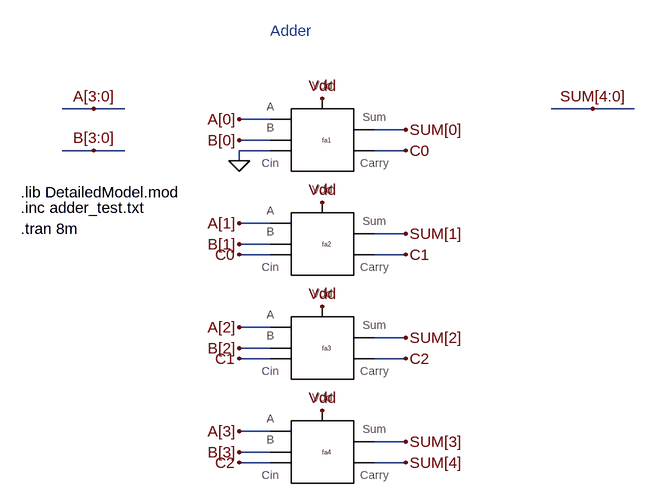
[diagram p0: schematic adder.asc]
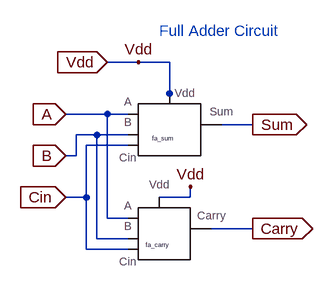
[diagram p1: sub-circuit fa.asc]
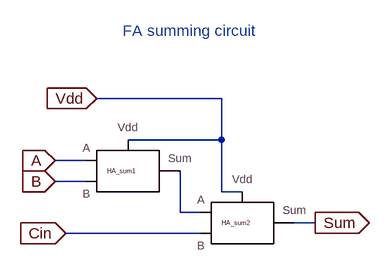
[diagram p2: sub-circuit fa_sum.asc]
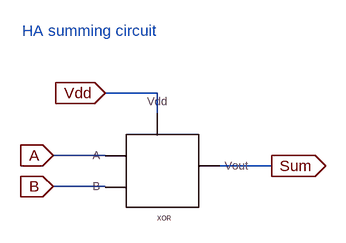
[diagram p3: sub-circuit ha_sum.asc]
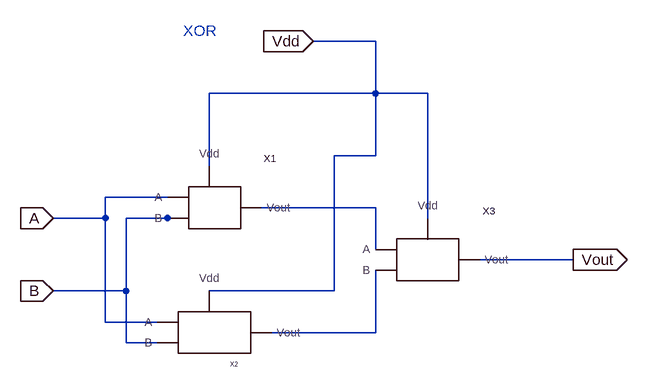
[diagram p4: sub-circuit my_xor.asc]
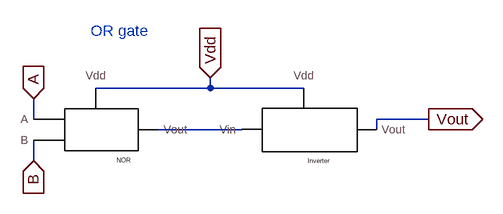
[diagram p5: sub-circuit my_or.asc]
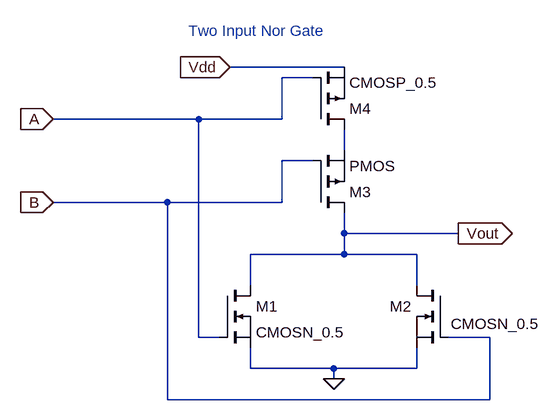
[diagram p6: sub-circuit my_nor.asc]
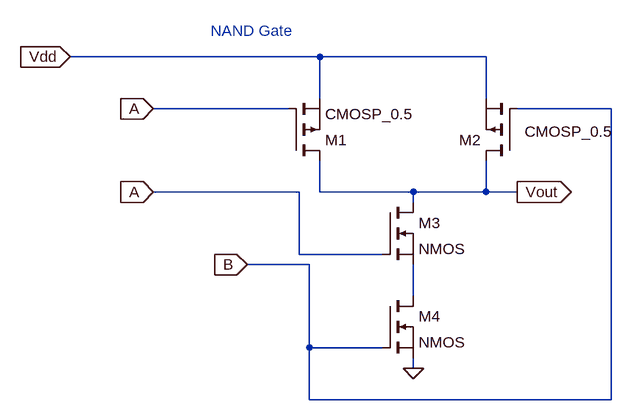
[diagram p7: sub-circuit my_nand.asc]
adder.asc, the LTspice schematic file:
Version 4
SHEET 1 968 680
WIRE 128 -16 80 -16
WIRE 176 -16 128 -16
WIRE 896 -16 832 -16
WIRE 960 -16 896 -16
WIRE 400 0 352 0
WIRE 608 16 560 16
WIRE 400 32 352 32
WIRE 128 48 80 48
WIRE 176 48 128 48
WIRE 400 48 352 48
WIRE 608 48 560 48
WIRE 352 64 352 48
WIRE 400 160 352 160
WIRE 608 176 560 176
WIRE 400 192 352 192
WIRE 400 208 352 208
WIRE 608 208 560 208
WIRE 400 320 352 320
WIRE 608 336 560 336
WIRE 400 352 352 352
WIRE 400 368 352 368
WIRE 608 368 560 368
WIRE 400 480 352 480
WIRE 608 496 560 496
WIRE 400 512 352 512
WIRE 400 528 352 528
WIRE 608 528 560 528
FLAG 128 -16 A[3:0]
FLAG 128 48 B[3:0]
FLAG 896 -16 SUM[4:0]
FLAG 352 64 0
FLAG 352 0 A[0]
FLAG 352 32 B[0]
FLAG 608 16 SUM[0]
FLAG 608 48 C0
FLAG 352 208 C0
FLAG 352 192 B[1]
FLAG 352 160 A[1]
FLAG 608 176 SUM[1]
FLAG 608 208 C1
FLAG 352 368 C1
FLAG 352 352 B[2]
FLAG 352 320 A[2]
FLAG 608 336 SUM[2]
FLAG 608 368 C2
FLAG 352 528 C2
FLAG 352 512 B[3]
FLAG 352 480 A[3]
FLAG 608 496 SUM[3]
FLAG 608 528 SUM[4]
FLAG 480 -32 Vdd
FLAG 480 128 Vdd
FLAG 480 288 Vdd
FLAG 480 448 Vdd
SYMBOL fa 480 32 R0
WINDOW 0 0 0 Left 0
SYMATTR InstName fa1
SYMBOL fa 480 192 R0
WINDOW 0 0 0 Left 0
SYMATTR InstName fa2
SYMBOL fa 480 352 R0
WINDOW 0 0 0 Left 0
SYMATTR InstName fa3
SYMBOL fa 480 512 R0
WINDOW 0 0 0 Left 0
SYMATTR InstName fa4
TEXT 16 112 Left 2 !.lib DetailedModel.mod
TEXT 16 136 Left 2 !.inc adder_test.txt
TEXT 16 168 Left 2 !.tran 8m
TEXT 400 -136 Left 2 ;Adder

fa.asc, the sub-circuit schematic file:
Version 4
SHEET 1 880 680
WIRE 128 -32 80 -32
WIRE 176 -32 128 -32
WIRE 176 16 176 -32
WIRE 176 32 176 16
WIRE 80 48 16 48
WIRE 112 48 80 48
WIRE 304 64 256 64
WIRE 64 80 32 80
WIRE 112 80 64 80
WIRE 112 96 48 96
WIRE 32 112 32 80
WIRE 32 112 16 112
WIRE 48 176 48 96
WIRE 48 176 16 176
WIRE 208 176 208 160
WIRE 208 176 160 176
WIRE 80 208 80 48
WIRE 112 208 80 208
WIRE 304 224 240 224
WIRE 64 240 64 80
WIRE 112 240 64 240
WIRE 48 256 48 176
WIRE 112 256 48 256
FLAG 16 48 A
IOPIN 16 48 In
FLAG 16 112 B
IOPIN 16 112 In
FLAG 16 176 Cin
IOPIN 16 176 In
FLAG 80 -32 Vdd
IOPIN 80 -32 In
FLAG 128 -32 Vdd
FLAG 208 160 Vdd
FLAG 304 64 Sum
IOPIN 304 64 Out
FLAG 304 224 Carry
IOPIN 304 224 Out
SYMBOL fa_sum 160 64 R0
SYMATTR InstName fa_sum
SYMBOL fa_carry 160 224 R0
SYMATTR InstName fa_carry
TEXT 160 -80 Left 2 ;Full Adder Circuit

fa_sum.asc, the sub-circuit schematic file:
Version 4
SHEET 1 880 680
WIRE 320 32 128 32
WIRE 320 96 320 32
WIRE 320 96 176 96
WIRE 112 128 64 128
WIRE 112 160 64 160
WIRE 320 176 320 96
WIRE 352 176 320 176
WIRE 256 208 256 144
WIRE 288 208 256 208
WIRE 464 224 432 224
WIRE 288 240 80 240
FLAG 64 128 A
IOPIN 64 128 In
FLAG 64 160 B
IOPIN 64 160 In
FLAG 80 240 Cin
IOPIN 80 240 In
FLAG 464 224 Sum
IOPIN 464 224 Out
FLAG 128 32 Vdd
IOPIN 128 32 In
SYMBOL ha_sum 176 144 R0
SYMATTR InstName HA_sum1
SYMBOL ha_sum 352 224 R0
SYMATTR InstName HA_sum2
TEXT 168 -72 Left 2 ;FA summing circuit

ha_sum.asc, the sub-circuit schematic file:
Version 4
SHEET 1 880 680
WIRE 208 0 128 0
WIRE 208 32 208 0
WIRE 128 96 48 96
WIRE 384 112 304 112
WIRE 128 144 48 144
FLAG 48 96 A
IOPIN 48 96 In
FLAG 48 144 B
IOPIN 48 144 In
FLAG 128 0 Vdd
IOPIN 128 0 In
FLAG 384 112 Sum
IOPIN 384 112 Out
SYMBOL my_xor 208 112 R0
SYMATTR InstName XOR
TEXT 0 -96 Left 2 ;HA summing circuit

my_xor.asc, the sub-circuit schematic file:
Version 4
SHEET 1 1232 680
WIRE 592 -160 496 -160
WIRE 592 -80 592 -160
WIRE 592 -80 336 -80
WIRE 672 -80 592 -80
WIRE 592 16 592 -80
WIRE 592 16 528 16
WIRE 336 32 336 -80
WIRE 272 80 176 80
WIRE 592 96 416 96
WIRE 176 112 176 80
WIRE 176 112 96 112
WIRE 272 112 208 112
WIRE 288 112 272 112
WIRE 672 112 672 -80
WIRE 592 160 592 96
WIRE 896 176 752 176
WIRE 208 224 208 112
WIRE 208 224 96 224
WIRE 528 224 528 16
WIRE 528 224 336 224
WIRE 176 272 176 112
WIRE 256 272 176 272
WIRE 592 288 592 192
WIRE 592 288 432 288
WIRE 208 304 208 224
WIRE 256 304 208 304
FLAG 96 112 A
IOPIN 96 112 In
FLAG 96 224 B
IOPIN 96 224 In
FLAG 496 -160 Vdd
IOPIN 496 -160 In
FLAG 896 176 Vout
IOPIN 896 176 Out
SYMBOL my_or 336 80 R0
SYMATTR InstName X1
SYMBOL my_nand 336 288 R0
SYMATTR InstName X2
SYMBOL my_and 672 176 R0
SYMATTR InstName X3
TEXT 296 -176 Left 2 ;XOR

my_or.asc, the sub-circuit schematic file:
Version 4
SHEET 1 880 680
WIRE 288 144 288 128
WIRE 288 144 112 144
WIRE 432 144 288 144
WIRE 16 192 16 160
WIRE 624 192 544 192
WIRE 336 208 208 208
WIRE 544 208 544 192
WIRE 16 256 16 224
FLAG 16 160 A
IOPIN 16 160 In
FLAG 16 256 B
IOPIN 16 256 In
FLAG 288 128 Vdd
IOPIN 288 128 In
FLAG 624 192 Vout
IOPIN 624 192 Out
SYMBOL my_nor 112 208 R0
SYMATTR InstName NOR
SYMBOL my_inverter 432 208 R0
SYMATTR InstName Inverter
TEXT 104 56 Left 2 ;OR gate

my_nor.asc, the sub-circuit schematic file:
Version 4
SHEET 1 880 680
WIRE 336 -240 160 -240
WIRE 288 -224 240 -224
WIRE 112 -160 -112 -160
WIRE 240 -160 240 -224
WIRE 240 -160 112 -160
WIRE 336 -112 336 -144
WIRE 288 -96 240 -96
WIRE 64 -32 -112 -32
WIRE 240 -32 240 -96
WIRE 240 -32 64 -32
WIRE 336 16 336 -16
WIRE 512 16 336 16
WIRE 336 48 336 16
WIRE 336 48 192 48
WIRE 448 48 336 48
WIRE 192 96 192 48
WIRE 448 96 448 48
WIRE 112 176 112 -160
WIRE 144 176 112 176
WIRE 560 176 496 176
WIRE 192 224 192 192
WIRE 320 224 192 224
WIRE 448 224 448 192
WIRE 448 224 320 224
WIRE 320 240 320 224
WIRE 64 272 64 -32
WIRE 560 272 560 176
WIRE 560 272 64 272
FLAG -112 -32 B
IOPIN -112 -32 In
FLAG -112 -160 A
IOPIN -112 -160 In
FLAG 160 -240 Vdd
IOPIN 160 -240 In
FLAG 512 16 Vout
IOPIN 512 16 Out
FLAG 320 240 0
SYMBOL nmos 144 96 R0
SYMATTR InstName M1
SYMATTR Value CMOSN_0.5
SYMBOL nmos 496 96 M0
WINDOW 3 -141 59 Left 2
SYMATTR Value CMOSN_0.5
SYMATTR InstName M2
SYMBOL pmos 288 -144 M180
SYMATTR InstName M4
SYMATTR Value CMOSP_0.5
SYMBOL pmos 288 -16 M180
SYMATTR InstName M3
TEXT 96 -296 Left 2 ;Two Input Nor Gate

my_nand.asc, the sub-circuit schematic file:
Version 4
SHEET 1 932 680
WIRE 480 -16 96 -16
WIRE 736 -16 480 -16
WIRE 480 48 480 -16
WIRE 736 48 736 -16
WIRE 432 64 224 64
WIRE 928 64 784 64
WIRE 448 192 224 192
WIRE 480 192 480 144
WIRE 624 192 480 192
WIRE 736 192 736 144
WIRE 736 192 624 192
WIRE 784 192 736 192
WIRE 624 208 624 192
WIRE 448 288 448 192
WIRE 576 288 448 288
WIRE 464 304 368 304
WIRE 624 352 624 304
WIRE 464 432 464 304
WIRE 576 432 464 432
WIRE 624 464 624 448
WIRE 464 512 464 432
WIRE 928 512 928 64
WIRE 928 512 464 512
FLAG 624 464 0
FLAG 96 -16 Vdd
IOPIN 96 -16 In
FLAG 224 64 A
IOPIN 224 64 In
FLAG 224 192 A
IOPIN 224 192 In
FLAG 368 304 B
IOPIN 368 304 In
FLAG 784 192 Vout
IOPIN 784 192 Out
SYMBOL pmos 432 144 M180
SYMATTR InstName M1
SYMATTR Value CMOSP_0.5
SYMBOL pmos 784 144 R180
WINDOW 3 -11 45 Right 2
SYMATTR Value CMOSP_0.5
SYMATTR InstName M2
SYMBOL nmos 576 208 R0
SYMATTR InstName M3
SYMBOL nmos 576 352 R0
SYMATTR InstName M4
TEXT 312 -56 Left 2 ;NAND Gate

my_and.asc, the sub-circuit schematic file:
Version 4
SHEET 1 880 680
WIRE 288 112 288 96
WIRE 288 112 128 112
WIRE 432 112 288 112
WIRE 48 160 48 128
WIRE 336 160 224 160
WIRE 592 160 544 160
WIRE 224 176 224 160
WIRE 336 176 336 160
WIRE 544 176 544 160
WIRE 48 224 48 192
FLAG 48 128 A
IOPIN 48 128 In
FLAG 48 224 B
IOPIN 48 224 In
FLAG 288 96 Vdd
IOPIN 288 96 In
FLAG 592 160 Vout
IOPIN 592 160 Out
SYMBOL my_nand 128 176 R0
SYMATTR InstName NAND
SYMBOL my_inverter 432 176 R0
SYMATTR InstName Inverter
TEXT 344 40 Left 2 ;AND

fa_carry.asc, the sub-circuit schematic file:
Version 4
SHEET 1 1564 680
WIRE 32 96 -16 96
WIRE 192 128 112 128
WIRE 576 144 496 144
WIRE 96 192 16 192
WIRE 384 192 304 192
WIRE 416 192 384 192
WIRE 512 192 416 192
WIRE 752 208 656 208
WIRE 512 224 384 224
WIRE 128 288 112 288
WIRE 192 288 128 288
WIRE 576 304 496 304
WIRE 1072 304 816 304
WIRE 752 336 752 208
WIRE 96 352 16 352
WIRE 384 352 384 224
WIRE 384 352 304 352
WIRE 512 352 384 352
WIRE 752 368 656 368
WIRE 512 384 432 384
WIRE 192 448 112 448
WIRE 1072 448 1072 304
WIRE 1232 448 1072 448
WIRE 592 464 496 464
WIRE 1072 464 1072 448
WIRE 1072 464 992 464
WIRE 896 496 896 352
WIRE 928 496 896 496
WIRE 96 512 16 512
WIRE 320 512 304 512
WIRE 432 512 432 384
WIRE 432 512 320 512
WIRE 528 512 432 512
WIRE 1136 512 1072 512
WIRE 1440 512 1344 512
WIRE 928 528 672 528
WIRE 416 544 416 192
WIRE 528 544 416 544
FLAG 16 192 A
IOPIN 16 192 In
FLAG 16 352 B
IOPIN 16 352 In
FLAG 16 512 Cin
IOPIN 16 512 In
FLAG 304 352 Bbar
FLAG 384 192 Abar
FLAG 320 512 Cbar
FLAG 1440 512 Carry
IOPIN 1440 512 Out
FLAG -16 96 Vdd
IOPIN -16 96 In
FLAG 1072 304 Vdd
FLAG 496 144 Vdd
FLAG 496 304 Vdd
FLAG 496 464 Vdd
FLAG 112 448 Vdd
FLAG 128 288 Vdd
FLAG 112 128 Vdd
FLAG 32 96 Vdd
SYMBOL my_inverter 192 192 R0
SYMATTR InstName inverter1
SYMBOL my_inverter 192 352 R0
SYMATTR InstName inverter2
SYMBOL my_inverter 192 512 R0
SYMATTR InstName inverter3
SYMBOL my_or 576 192 R0
WINDOW 0 0 0 Left 0
SYMATTR InstName or1
SYMBOL my_or 576 352 R0
WINDOW 0 0 0 Left 0
SYMATTR InstName or2
SYMBOL my_or 592 512 R0
WINDOW 0 0 0 Left 0
SYMATTR InstName or3
SYMBOL ha_sum 816 352 R0
SYMATTR InstName ha_sum1
SYMBOL ha_sum 992 512 R0
SYMATTR InstName ha_sum2
SYMBOL my_inverter 1232 512 R0
SYMATTR InstName inverter4
TEXT 824 144 Left 2 ;FA carry circuit

The netlist it stands for:
* adder.asc
Xfa1 A[0] B[0] 0 SUM[0] C0 Vdd fa
Xfa2 A[1] B[1] C0 SUM[1] C1 Vdd fa
Xfa3 A[2] B[2] C1 SUM[2] C2 Vdd fa
Xfa4 A[3] B[3] C2 SUM[3] SUM[4] Vdd fa

* block symbol definitions
.subckt fa A B Cin Sum Carry Vdd
Xfa_sum A B Cin Sum Vdd fa_sum
Xfa_carry A B Cin Carry Vdd fa_carry
* Full Adder Circuit
.ends fa

.subckt fa_sum A B Cin Sum Vdd
XHA_sum1 A B N001 Vdd ha_sum
XHA_sum2 N001 Cin Sum Vdd ha_sum
* FA summing circuit
.ends fa_sum

.subckt ha_sum A B Sum Vdd
XXOR A B Vdd Sum my_xor
* HA summing circuit
.ends ha_sum

.subckt my_xor A B Vdd Vout
XX1 A B Vdd N001 my_or
XX2 A B N002 Vdd my_nand
XX3 N001 N002 Vout Vdd my_and
* XOR
.ends my_xor

.subckt my_or A B Vdd Vout
XNOR A B N001 Vdd my_nor
XInverter N001 Vdd Vout my_inverter  ; pins Vin Vdd Vout
* OR gate
.ends my_or

.subckt my_nor A B Vout Vdd
M1 Vout A 0 0 CMOSN_0.5
M2 Vout B 0 0 CMOSN_0.5
M4 N001 A Vdd Vdd CMOSP_0.5
M3 Vout B N001 N001 PMOS
* Two Input Nor Gate
.ends my_nor

.subckt my_nand A B Vout Vdd
M1 Vout A Vdd Vdd CMOSP_0.5
M2 Vout B Vdd Vdd CMOSP_0.5
M3 Vout A N001 N001 NMOS
M4 N001 B 0 0 NMOS
* NAND Gate
.ends my_nand

.subckt my_and A B Vout Vdd
XNAND A B N001 Vdd my_nand
XInverter N001 Vdd Vout my_inverter  ; pins Vin Vdd Vout
* AND
.ends my_and

.subckt fa_carry A B Cin Carry Vdd
Xinverter1 A Vdd Abar my_inverter  ; pins Vin Vdd Vout
Xinverter2 B Vdd Bbar my_inverter  ; pins Vin Vdd Vout
Xinverter3 Cin Vdd Cbar my_inverter  ; pins Vin Vdd Vout
Xor1 Abar Bbar Vdd N001 my_or
Xor2 Bbar Cbar Vdd N002 my_or
Xor3 Cbar Abar Vdd N005 my_or
Xha_sum1 N001 N002 N003 Vdd ha_sum
Xha_sum2 N003 N005 N004 Vdd ha_sum
Xinverter4 N004 Vdd Carry my_inverter  ; pins Vin Vdd Vout
* FA carry circuit
.ends fa_carry

.model NMOS NMOS
.model PMOS PMOS
.lib standard.mos
.lib DetailedModel.mod
.inc adder_test.txt
.tran 8m
* Adder
.backanno
.end